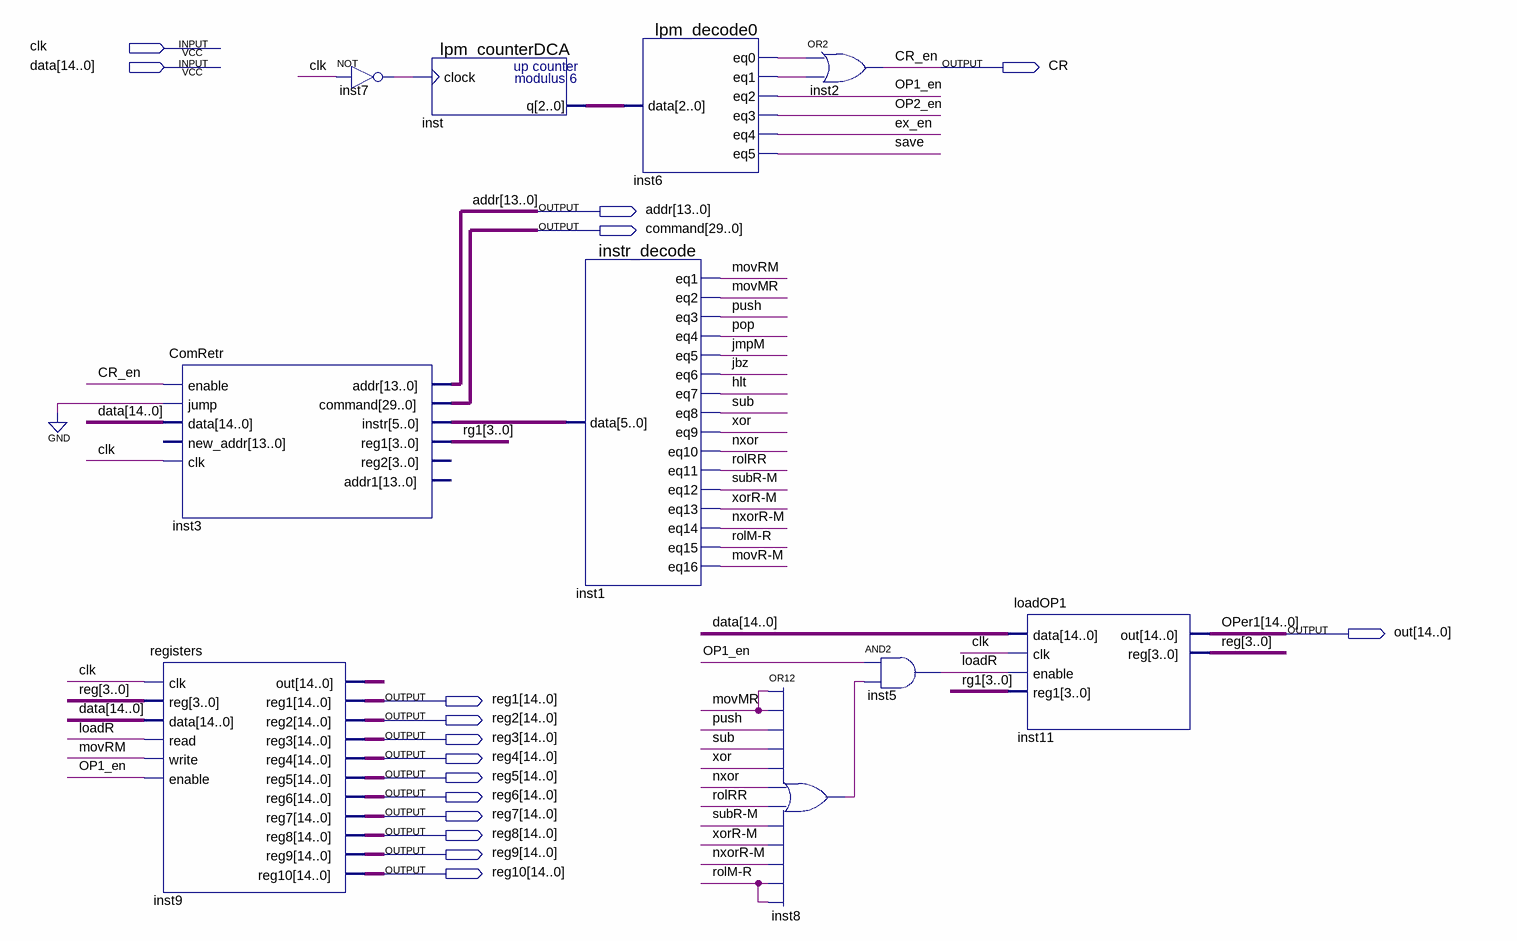
[diagram p0: schematic sheet]
// Quartus schematic cpu.bdf as structural Verilog: 10 symbols, 16 pins
module cpu (
  input  clk,
  input  [14:0] data,
  output CR,
  output [13:0] addr,
  output [29:0] command,
  output [14:0] out,
  output [14:0] reg1,
  output [14:0] reg2,
  output [14:0] reg3,
  output [14:0] reg4,
  output [14:0] reg5,
  output [14:0] reg6,
  output [14:0] reg7,
  output [14:0] reg8,
  output [14:0] reg9,
  output [14:0] reg10
);

  wire ex_en, hlt, inst6_eq0, inst6_eq1, inst7_out, inst8_out, jbz, jmpM, loadR, movMR, \movR-M , movRM,
       nxor, \nxorR-M , OP1_en, OP2_en, pop, push, \rolM-R , rolRR, save, sub, \subR-M , \xor , \xorR-M ;
  wire [2:0] inst_q;
  wire [3:0] \reg , rg1;
  wire [5:0] inst3_instr;
  wire [14:0] inst9_out;

  registers inst9 (
    .clk(clk), .\reg (\reg ), .data(data), .read(loadR), .write(movRM), .enable(OP1_en), .out(inst9_out),
    .reg1(reg1), .reg2(reg2), .reg3(reg3), .reg4(reg4), .reg5(reg5), .reg6(reg6), .reg7(reg7), .reg8(reg8),
    .reg9(reg9), .reg10(reg10));
  ComRetr inst3 (
    .enable(CR), .jump(1'b0), .data(data), .clk(clk), .addr(addr), .command(command), .instr(inst3_instr),
    .reg1(rg1));  // open: new_addr, reg2, addr1
  not inst7 (inst7_out, clk);
  lpm_counterDCA inst (.clock(inst7_out), .q(inst_q));
  instr_decode inst1 (
    .data(inst3_instr), .eq1(movRM), .eq2(movMR), .eq3(push), .eq4(pop), .eq5(jmpM), .eq6(jbz), .eq7(hlt),
    .eq8(sub), .eq9(\xor ), .eq10(nxor), .eq11(rolRR), .eq12(\subR-M ), .eq13(\xorR-M ), .eq14(\nxorR-M ),
    .eq15(\rolM-R ), .eq16(\movR-M ));
  lpm_decode0 inst6 (
    .data(inst_q), .eq0(inst6_eq0), .eq1(inst6_eq1), .eq2(OP1_en), .eq3(OP2_en), .eq4(ex_en), .eq5(save));
  or inst2 (CR, inst6_eq0, inst6_eq1);
  or inst8 (inst8_out, movMR, movMR, push, sub, \xor , nxor, rolRR, \subR-M , \xorR-M , \nxorR-M , \rolM-R , \rolM-R );
  and inst5 (loadR, OP1_en, inst8_out);
  loadOP1 inst11 (.data(data), .clk(clk), .enable(loadR), .reg1(rg1), .out(out), .\reg (\reg ));

  // Other names for the same wires on the sheet: CR_en = CR; OPer1[14:0] = out
endmodule
